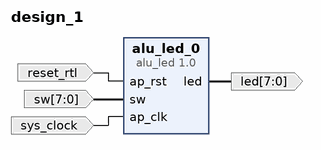
[diagram p0: block diagram of the top level]
# Vivado block design design_1, xc7z020clg484-1, Vivado 2023.1
create_bd_design design_1

create_bd_port -dir I -from 7 -to 0 sw
create_bd_port -dir O -from 7 -to 0 led
create_bd_port -dir I -type clk sys_clock
set_property -dict {CONFIG.FREQ_HZ 100000000 CONFIG.PHASE 0.0} [get_bd_ports sys_clock]
create_bd_port -dir I -type rst reset_rtl
set_property -dict {CONFIG.POLARITY ACTIVE_HIGH} [get_bd_ports reset_rtl]

create_bd_cell -type ip -vlnv xilinx.com:hls:alu_led:1.0 alu_led_0

# ---- connections ----

connect_bd_net [get_bd_pins alu_led_0/led] [get_bd_ports led]
connect_bd_net [get_bd_ports reset_rtl] [get_bd_pins alu_led_0/ap_rst]
connect_bd_net [get_bd_ports sw] [get_bd_pins alu_led_0/sw]
connect_bd_net [get_bd_ports sys_clock] [get_bd_pins alu_led_0/ap_clk]

validate_bd_design
save_bd_design
